# EAGLE design HedleySensorRevB (EAGLE 7.2.0)
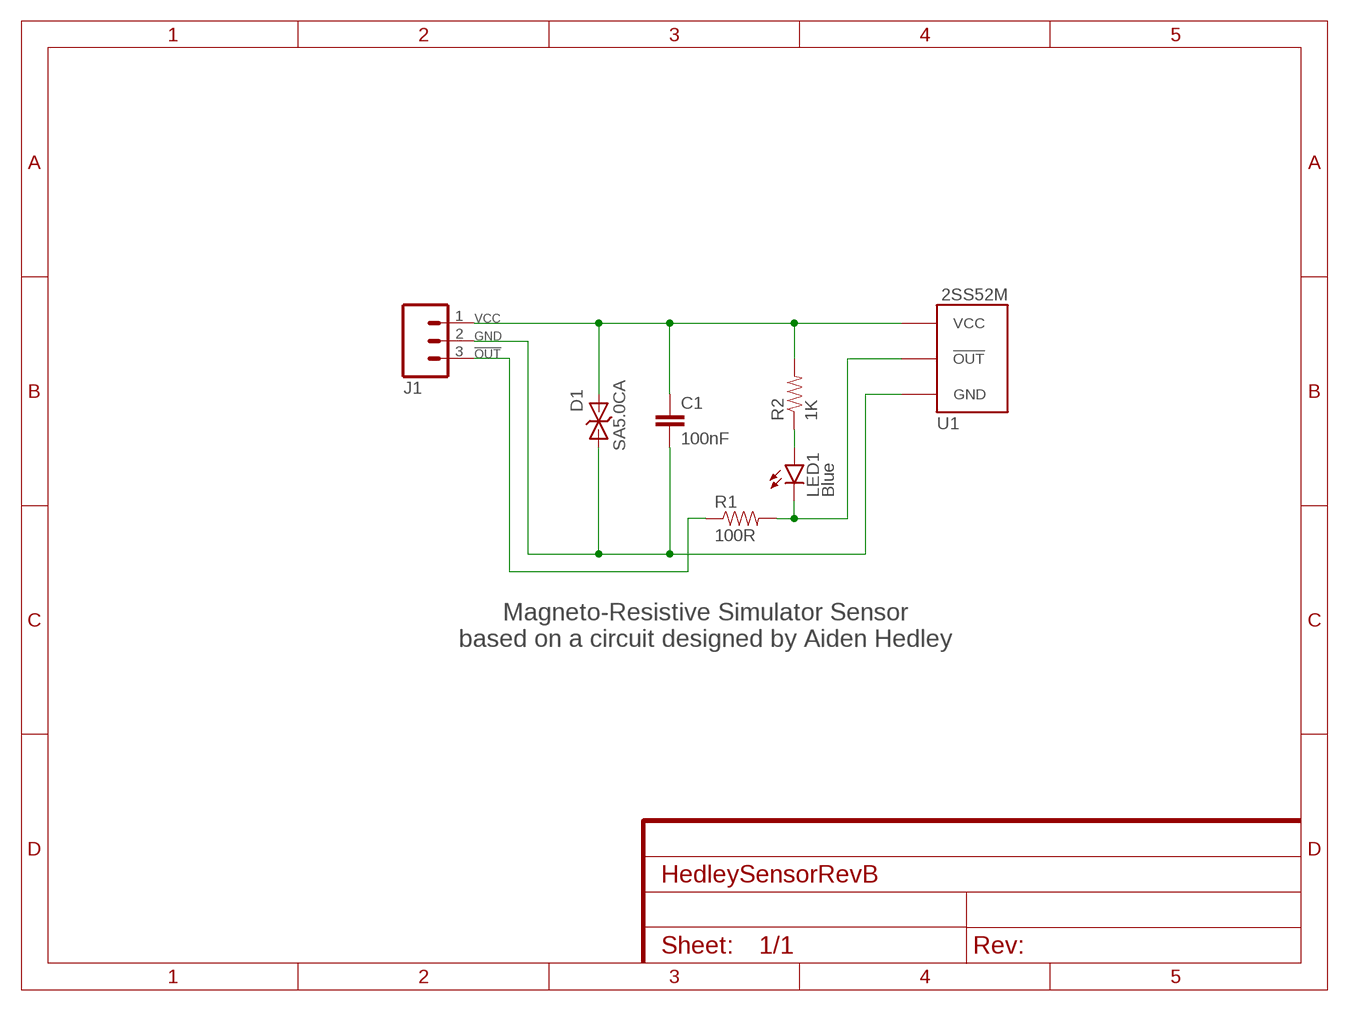
[diagram p0: schematic, sheet 1]
FRAME1 (FRAME-A5L): CNAME: Hedley Magneto-Resistive Simulator Sensor; CREVISION: B; DESIGNER: Andrew Instone-Cowie

## Parts
C1  100nF  CAPPTH  [CAP-PTH-SMALL]
D1  SA5.0CA  [DO41_TVS]
J1  M03PTH  [1X03]
LED1  Blue  LED3MM  [LED3MM]
R1  100R  RESISTORPTH-1/4W  [AXIAL-0.4]
R2  1K  RESISTORPTH-1/4W  [AXIAL-0.4]
U1  2SS52MFLAT  [2SS52M_FLAT]

## Nets
!OUT: J1.3 R1.P$1
GND: C1.2 D1.A J1.2 U1.P$1(GND)
N$1: LED1.K(C) R1.P$2 U1.P$2(!OUT!)
N$3: LED1.A R2.P$1
VCC: C1.1 D1.C J1.1 R2.P$2 U1.P$3(VCC)

## Notes on the sheet
- Magneto-Resistive Simulator Sensor
  based on a circuit designed by Aiden Hedley

## Library data of the parts
C1 = SparkFun-Passives:CAP: Capacitor Standard 0603 ceramic capacitor, and 0.1" leaded capacitor.
D1 = AIC_Custom:SA5.0CA: SA5.0CA TVS Bi-Directional Transient Voltage Suppressor. 5V, DO41 package
J1 = SparkFun-Connectors:M03: Header 3 Standard 3-pin 0.1" header. Use with straight break away headers (SKU : PRT-00116), right angle break away headers (PRT-00553), swiss pins (PRT-00743), machine pins (PRT-00117), and female headers (PRT-00115). Molex polarized connector foot print use with SKU : PRT-08232 with associated crimp pins and housings.
LED1 = SparkFun-LED:LED: LEDs Standard schematic elements and footprints for 5mm, 3mm, 1206, and 0603 sized LEDs. 5mm - Spark Fun Electronics SKU : COM-00529 (and others)
R1 R2 = SparkFun-Passives:RESISTOR: Resistor Basic schematic elements and footprints for 0603, 1206, and PTH resistors.
U1 = AIC_Custom:2SS52M: Honeywell 2SS52M Magnetoresistive Detector

## Board
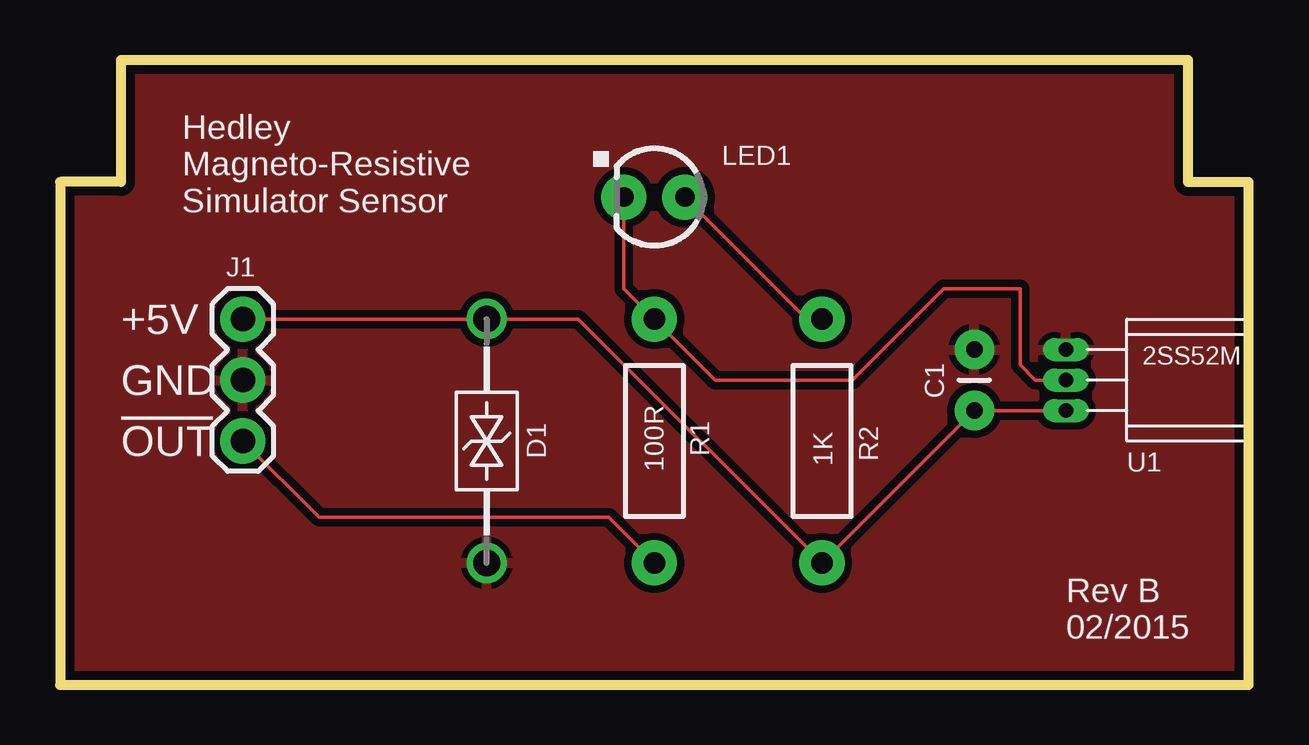
[diagram p1: board, top side]
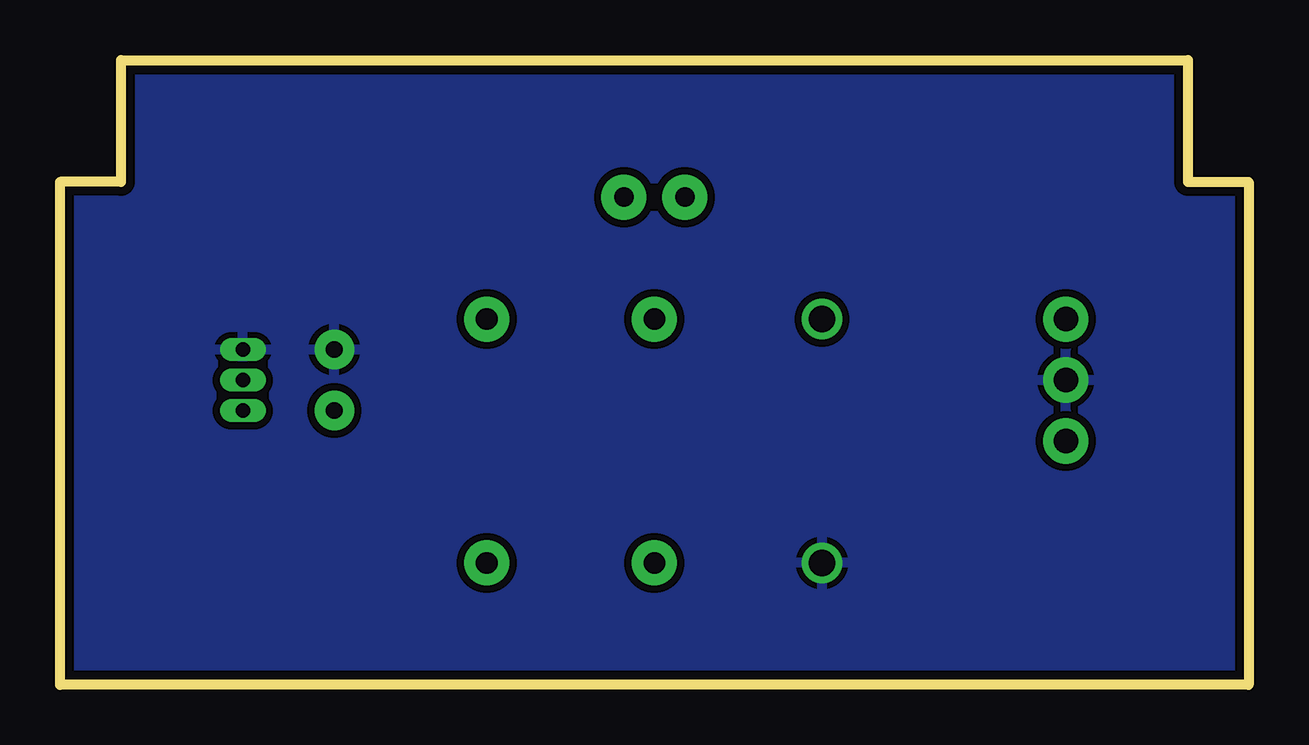
[diagram p2: board, bottom side, seen from below]

Size 49.53 x 26.04 mm. Coordinates in mm from the lower left corner, seen from the top.
Outline: 0,0 49.53,0 49.53,20.95 46.99,20.95 46.99,26.04 2.54,26.04 2.54,20.95 0,20.95 0,0
Copper layers (1*16): Top 0.0356mm / dielectric 1.5011mm / Bottom 0.0356mm
Design rules "LaenPCBOrder(OSHPARK)": minimum track width 6mil, minimum drill 13mil, track to track 6mil, track to pad 6mil, pad to pad 6mil, via to via 6mil, smd to smd 6mil, copper to edge 15mil, drill to drill 6mil, minimum pad ring 7mil, minimum via ring 7mil, stop-mask expansion 3mil, vias tented up to drill 0mil, thermal gap 10mil

### Footprints (pad centres in the part's own frame; a part is rotated, then mirrored left to right if it is on the bottom)
CAP-PTH-SMALL = drill 0.7 pad 1.651: 1 0,0; 2 2.54,0
DO41_TVS = drill 1.118: A 5.08,0; C -5.08,0
1X03 = drill 1.016 pad 1.88: 1 0,0; 2 2.54,0; 3 5.08,0
LED3MM = drill 0.813 pad 1.88: A -1.27,0; K 1.27,0
AXIAL-0.4 = drill 0.9 pad 1.88: P$1 -5.08,0; P$2 5.08,0
2SS52M_FLAT = drill 0.6 pad 0.813 long: P$1 -5.08,1.27; P$2 -5.08,0; P$3 -5.08,-1.27

### Placement (x,y rotation side)
C1  38.1,11.43 90 top
D1  17.78,10.16 270 top
J1  7.62,15.24 270 top
LED1  24.77,20.32 180 top
R1  24.77,10.16 90 top
R2  31.75,10.16 270 top
U1  46.99,12.7 0 top

### Tracks (layer width: path | path; a pad name or v marks a point on that pad's centre or on a via)
!OUT
  Top 0.152: J1.3 10.79,6.99 22.86,6.99 R1.P$1
GND
  pour Bottom (isolate 0.305): 2.54,26.04 2.54,20.95 0,20.95 0,0 49.53,0 49.53,20.95 46.99,20.95 46.99,26.04
  pour Top (isolate 0.305): 2.54,26.04 2.54,20.95 0,20.95 0,0 49.53,0 49.53,20.95 46.99,20.95 46.99,26.04
N$1
  Top 0.152: LED1.K 23.5,16.51 R1.P$2 27.3,12.7 33.02,12.7 36.83,16.51 40.01,16.51 40.01,13.34 40.64,12.7 U1.P$2
  Bottom 0.152: 24.13,19.68 LED1.K
N$3
  Top 0.152: LED1.A 31.11,15.24 R2.P$1
VCC
  Top 0.152: U1.P$3 C1.1 R2.P$2 21.59,15.24 D1.C J1.1

### Text on the board
tPlace: Hedley / Magneto-Resistive / Simulator Sensor | +5V / GND / !OUT | Rev B / 02/2015